# Altium project KeyBaord_V0.1.PrjPcb
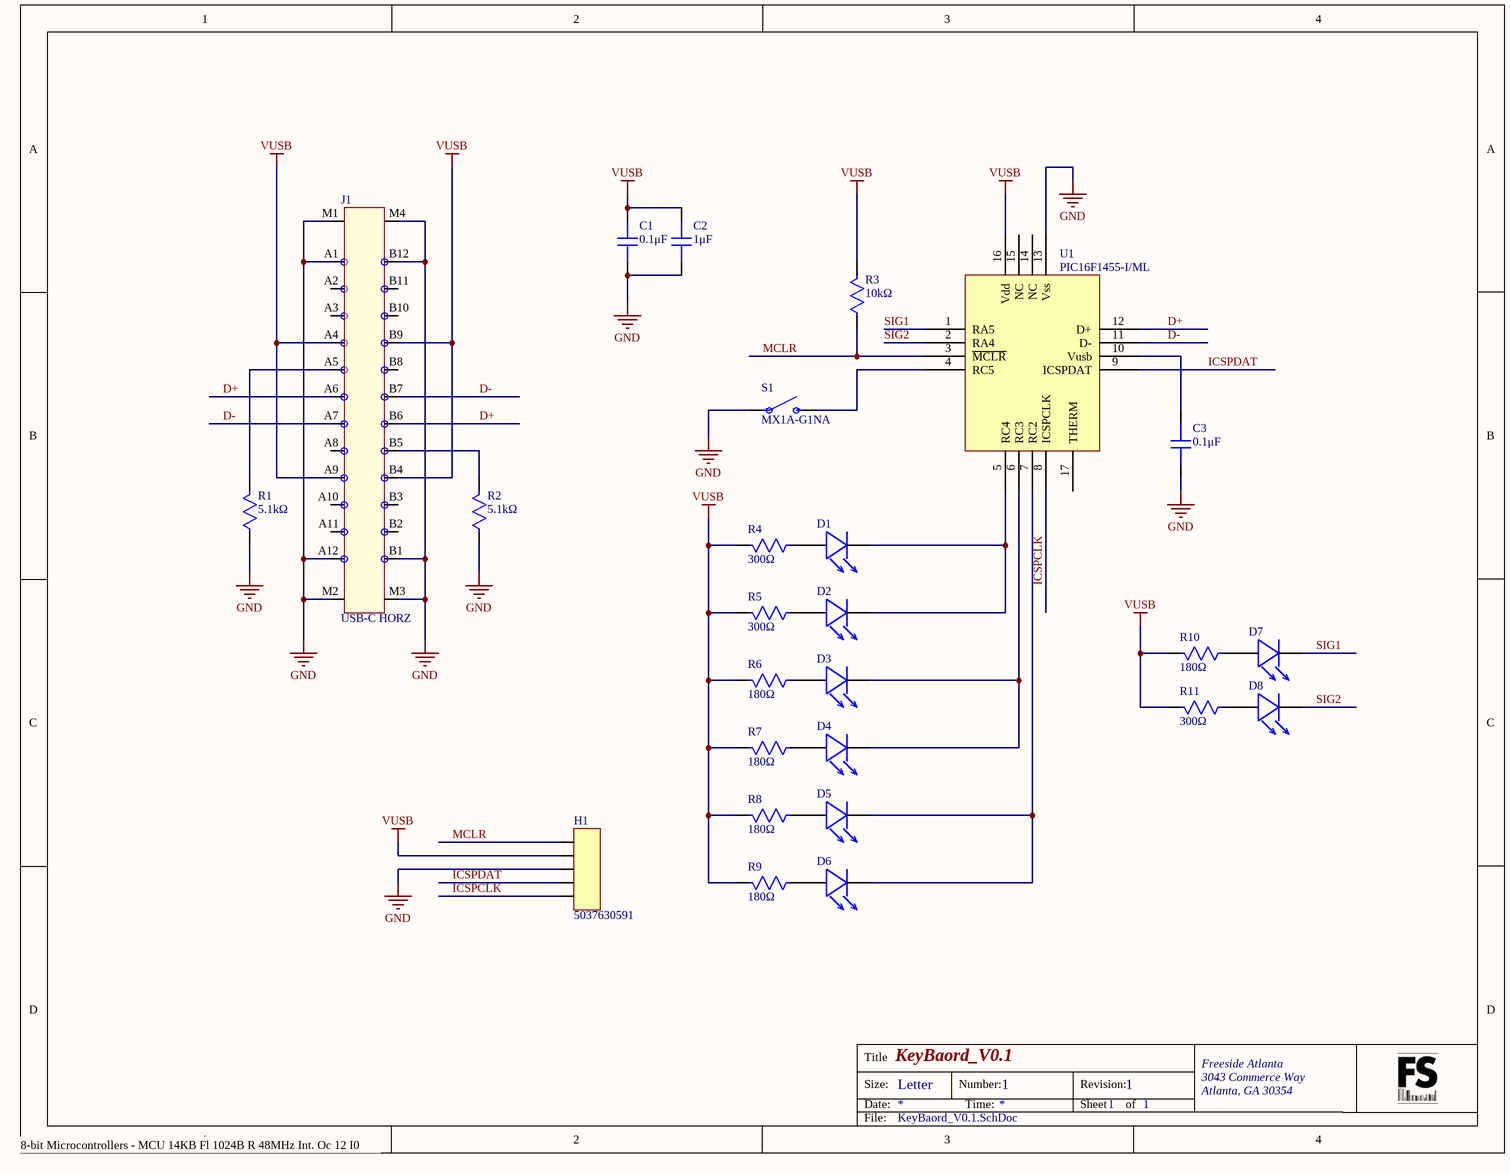
[diagram p0: KeyBaord_V0.1.SchDoc]
1 sheet, 26 parts. Net scope: global (net labels, ports and power ports of the same name join across sheets).
Board file: KeyBaord_V0.1.PcbDoc

## Sheet KeyBaord_V0.1.SchDoc: KeyBaord_V0.1
size Letter; Organization: Freeside Atlanta; Address1: 3043 Commerce Way; Address2: Atlanta, GA 30354; DocumentNumber: 1; Revision: 1; SheetNumber: 1; SheetTotal: 1

### Parts
C1  0.1μF  [AVX_MLCC_X7R-0402C]
C2  1μF  [AVX_MLCC_X7R-0805N]
C3  0.1μF  [AVX_MLCC_X7R-0402C]
D1  0603 Red  [150060RS55040]  (value not drawn)
D2  0603 Red  [150060RS55040]  (value not drawn)
D3  0603 Green  [150060GS55040]  (value not drawn)
D4  0603 Green  [150060GS55040]  (value not drawn)
D5  0603 Blue  [150060BS55040]  (value not drawn)
D6  0603 Blue  [150060BS55040]  (value not drawn)
D7  0603 Blue  [150060BS55040]  (value not drawn)
D8  0603 Red  [150060RS55040]  (value not drawn)
H1  5037630591  [5037630591]
J1  USB-C HORZ  [Molex_USB-C HORZ]
R1  5.1kΩ  [0402_2GE]
R2  5.1kΩ  [0402_2GE]
R3  10kΩ  [0402_2GE]
R4  300Ω  [0402_2GE]
R5  300Ω  [0402_2GE]
R6  180Ω  [0402_2GE]
R7  180Ω  [0402_2GE]
R8  180Ω  [0402_2GE]
R9  180Ω  [0402_2GE]
R10  180Ω  [0402_2GE]
R11  300Ω  [0402_2GE]
S1  MX1A-G1NA  [MX1A-G1NA]
U1  PIC16F1455-I/ML  [PIC16F1455-I/ML]

### Nets
GND: C1.1 C2.1 C3.1 H1.3 J1.A1 J1.A12 J1.B1 J1.B12 J1.M1 J1.M2 J1.M3 J1.M4 R1.2 R2.2 S1.1 U1.13(Vss)
VUSB: C1.2 C2.2 H1.4 J1.A4 J1.A9 J1.B4 J1.B9 R3.1 R4.1 R5.1 R6.1 R7.1 R8.1 R9.1 R10.1 R11.1 U1.16(Vdd)
D+: J1.A6 J1.B6 U1.12(D+)
D-: J1.A7 J1.B7 U1.11(D-)
ICSPCLK: H1.1 U1.8(ICSPCLK)
ICSPDAT: H1.2 U1.9(ICSPDAT)
MCLR: H1.5 R3.2 U1.3(~{MCLR})
SIG1: D7.C U1.1(RA5)
SIG2: D8.C U1.2(RA4)
NetC3_2: C3.2 U1.10(Vusb)
NetD1_A: D1.A R4.2
NetD1_C: D1.C D2.C U1.5(RC4)
NetD2_A: D2.A R5.2
NetD3_A: D3.A R6.2
NetD3_C: D3.C D4.C U1.6(RC3)
NetD4_A: D4.A R7.2
NetD5_A: D5.A R8.2
NetD5_C: D5.C D6.C U1.7(RC2)
NetD6_A: D6.A R9.2
NetD7_A: D7.A R10.2
NetD8_A: D8.A R11.2
NetJ1_A5: J1.A5 R1.1
NetJ1_B5: J1.B5 R2.1
NetS1_2: S1.2 U1.4(RC5)

Not connected (* = marked no-connect by the designer): J1 A2 A3 A8 A10 A11 B2 B3 B8 B10 B11; U1 14(NC) 15(NC) 17(THERM)

### Notes on the sheet
- 8-bit Microcontrollers - MCU 14KB Fl 1024B R 48MHz Int. Oc 12 I0
- Title
- Size:
- Date:
- Letter
- Number:
- Time:
- Revision:
- Sheet
- of
- File:

### Library data of the parts
C1 C3 = 0402ZC104MAT2A: MLCC C0G 0402 10V 0.1μF 20%; ID: 154; MAN: AVX; MPN: 0402ZC104MAT2A; Case: 0402; Voltage: 10V; Capacitance: 0.1μF; Tolerance: 20%
C2 = 0805ZC105MAT2A: MLCC C0G 0805 10V 1μF 20%; ID: 2348; MAN: AVX; MPN: 0805ZC105MAT2A; Case: 0805; Voltage: 10V; Capacitance: 1μF; Tolerance: 20%
D1 D2 D8 = 150060RS55040: Standard LEDs - SMD WL-SMCD SMD MonoChip 0603 Red 632nm; MAN: Wurth; Current: 20mA; Forward Voltage: 2V; MPN: 150060RS55040
D3 D4 = 150060GS55040: Standard LEDs - SMD WL-SMCD SMD Mono SMD 0603 Green 520nm; MAN: Wurth; Current: 20mA; Forward Voltage: 3.2V; MPN: 150060GS55040
D5-D7 = 150060BS55040: Standard LEDs - SMD WL-SMCD SMD Mono SMD 0603 Blue 465nm; MAN: Wurth; Current: 20mA; Forward Voltage: 3.2V; MPN: 150060BS55040
H1 = 5037630591: Headers & Wire Housings 1MM PicoLock SMT HDR RA POD SIDELOCK 5CKT; MAN: Molex; MPN: 5037630591
J1 = USB-C_HORZ: CONN RCP USB3.1 TYPEC 24P SMD RA; MPN: 1054500101; MAN: Molex; Digi-Key Part Number: WM12856CT-ND
R1 R2 = ERJ-2GEJ512X: Thick Film Resistors - SMD 0402 5.1Kohms 5% AEC-Q200; MAN: Panasonic; Wattage: 0.1W; ID: 9247; MPN: ERJ-2GEJ512X; Resistance: 5.1kΩ; Case: 0402; Tolerance: 5%
R3 = ERJ-2GEJ103X: Thick Film Resistors - SMD 0402 10Kohms 5% AEC-Q200; MAN: Panasonic; Wattage: 0.1W; ID: 9123; MPN: ERJ-2GEJ103X; Resistance: 10kΩ; Case: 0402; Tolerance: 5%
R4 R5 R11 = ERJ-2GEJ301X: Thick Film Resistors - SMD 0402 300ohms 5% AEC-Q200; MAN: Panasonic; Wattage: 0.1W; ID: 9202; MPN: ERJ-2GEJ301X; Resistance: 300Ω; Case: 0402; Tolerance: 5%
R6-R10 = ERJ-2GEJ181X: Thick Film Resistors - SMD 0402 180ohms 5% AEC-Q200; MAN: Panasonic; Wattage: 0.1W; ID: 9159; MPN: ERJ-2GEJ181X; Resistance: 180Ω; Case: 0402; Tolerance: 5%
S1 = MX1A-G1NA: Pushbutton Switches MX RGB, Brown Stem, Full Travel Mechanical Keyswitch Soft click Feel, 55cN, clear housing No Diode Frame Mount (no fixation pins); MAN: CHERRY; MPN: MX1A-G1NA
U1 = PIC16F1455-I/ML: 8-bit Microcontrollers - MCU 14KB Fl 1024B R 48MHz Int. Oc 12 I0; MAN: Microchip Technology; MPN: PIC16F1455-I/ML